# EAGLE design Selektorrad (EAGLE 6.1)
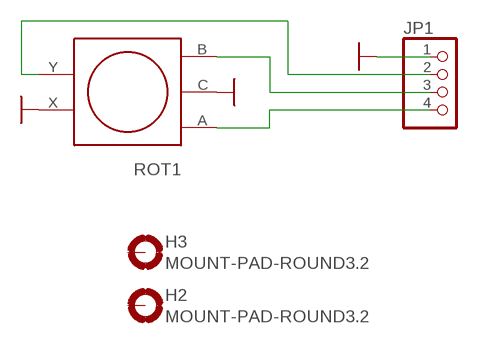
[diagram p0: schematic, sheet 1]

## Parts
H2  MOUNT-PAD-ROUND3.2  [3,2-PAD]
H3  MOUNT-PAD-ROUND3.2  [3,2-PAD]
JP1  PINHD-1X4  [1X04]
ROT1  STEC12E08  [EC12E24244]

## Nets
GND: JP1.1 ROT1.C ROT1.X
N$1: JP1.3 ROT1.B
N$6: JP1.4 ROT1.A
N$15: JP1.2 ROT1.Y
Unconnected: H2.B3,2(MOUNT) H3.B3,2(MOUNT)

## Library data of the parts
H2 H3 = holes:MOUNT-PAD-ROUND: MOUNTING PAD, round
JP1 = pinhead:PINHD-1X4: PIN HEADER
ROT1 = alps:STEC12E08

## Board
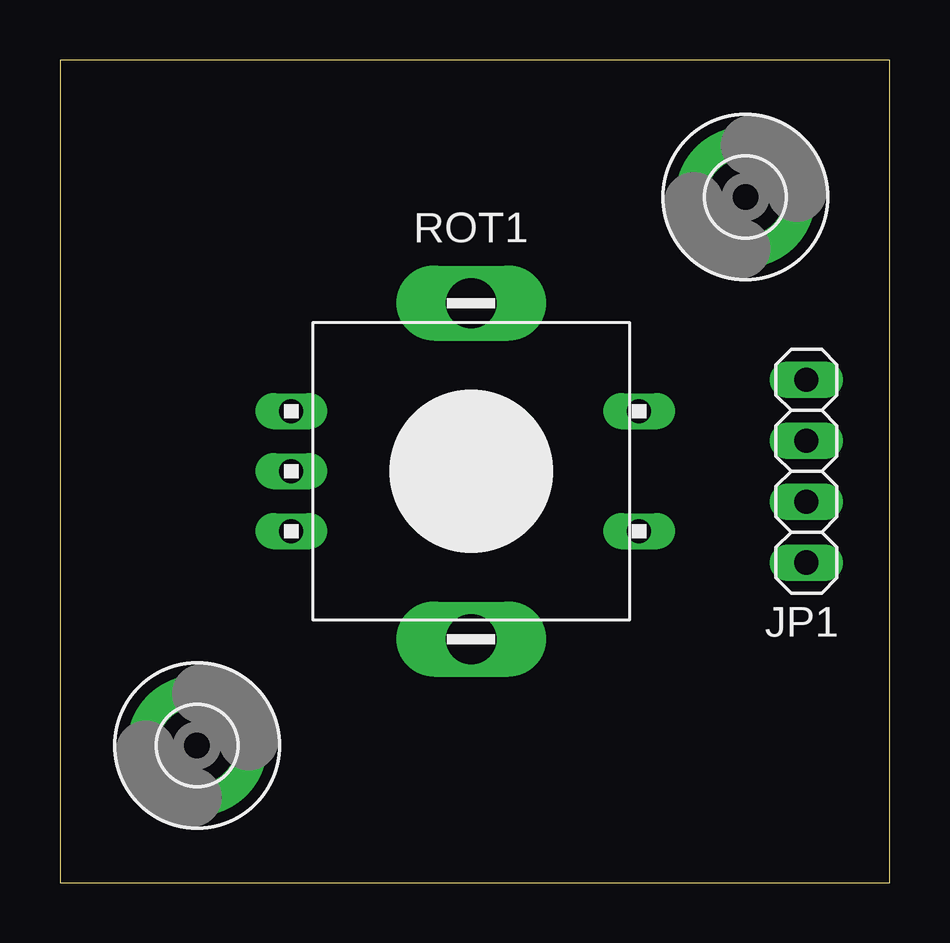
[diagram p1: board, top side]
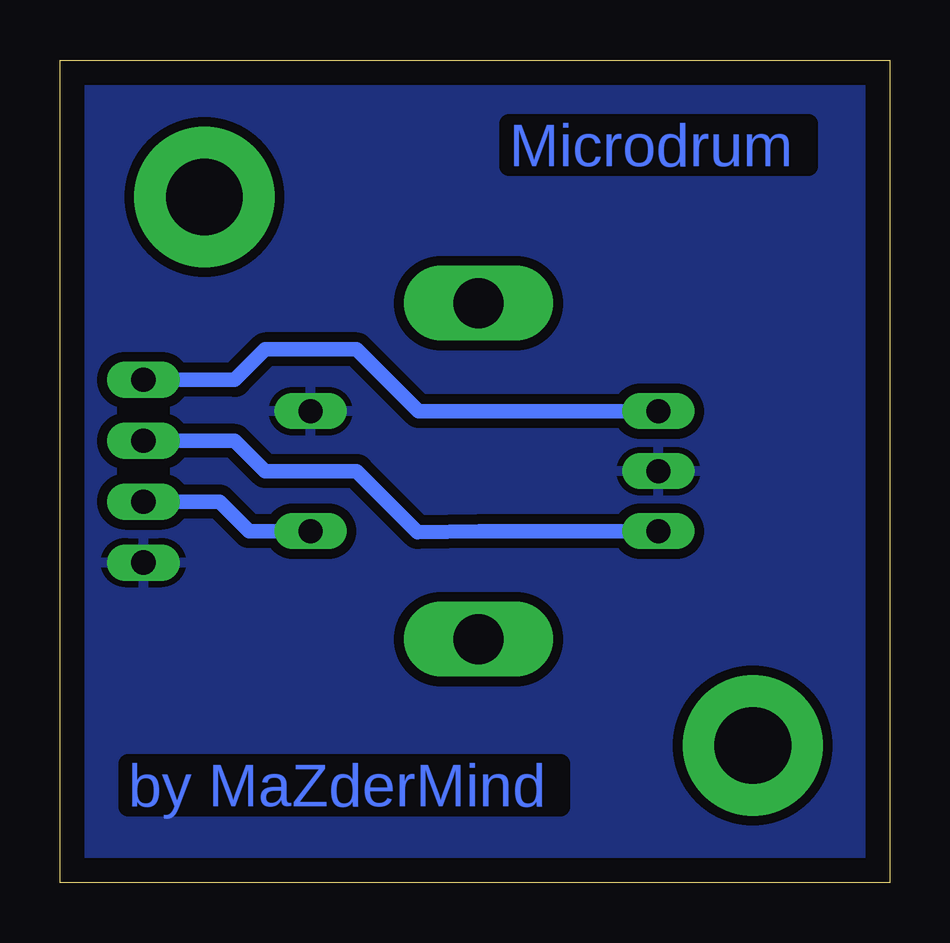
[diagram p2: board, bottom side, seen from below]

Size 34.59 x 34.28 mm. Coordinates in mm from the lower left corner, seen from the top.
Outline: 0,0 34.59,0 34.59,34.28 0,34.28 0,0
Copper layers (1*16): Top 0.035mm / dielectric 1.5mm / Bottom 0.035mm
Design rules: minimum track width 10mil, minimum drill 24mil, track to track 8mil, track to pad 8mil, pad to pad 8mil, via to via 8mil, smd to smd 8mil, copper to edge 40mil, drill to drill 8mil, minimum pad ring 10mil, minimum via ring 8mil, stop-mask expansion 4mil, vias tented up to drill 0mil, thermal gap 10mil

### Footprints (pad centres in the part's own frame; a part is rotated, then mirrored left to right if it is on the bottom)
3,2-PAD = drill 3.2 pad 5.842: B3,2 0,0
1X04 = drill 1.016 long: 1 -3.81,0; 2 -1.27,0; 3 1.27,0; 4 3.81,0
EC12E24244 = drill 1 long: A -2.5,-7.5; B 2.5,-7.5; C 0,-7.5; X -2.5,7; Y 2.5,7 | drill 2.1 long: CASE1 -7,0; CASE2 7,0

### Placement (x,y rotation side)
H2  28.57,28.57 0 top
H3  5.71,5.71 0 top
JP1  31.11,17.14 90 top
ROT1  17.14,17.14 270 top

### Tracks (layer width: path | path; a pad name or v marks a point on that pad's centre or on a via)
GND
  pour Bottom (isolate 0.406): 0,34.29 34.92,34.29 34.92,0 0,0
N$1
  Bottom 0.61: ROT1.B 17.11,14.64 19.68,14.61 22.23,17.14 26.04,17.14 27.3,18.41 JP1.3
N$6
  Bottom 0.61: JP1.4 27.3,20.95 26.04,22.23 22.23,22.23 19.64,19.64 ROT1.A
N$15
  Bottom 0.61: 24.14,14.61 ROT1.Y 26.71,14.64 27.94,15.88 JP1.2

### Text on the board
Bottom: Microdrum | by MaZderMind